# Altium schematic sheet FreshPal Schematic.SchDoc: FreshPal Schemtic V1
size 381 x 254 mm; Author: Tejus Samir; SheetNumber: 1; SheetTotal: 1
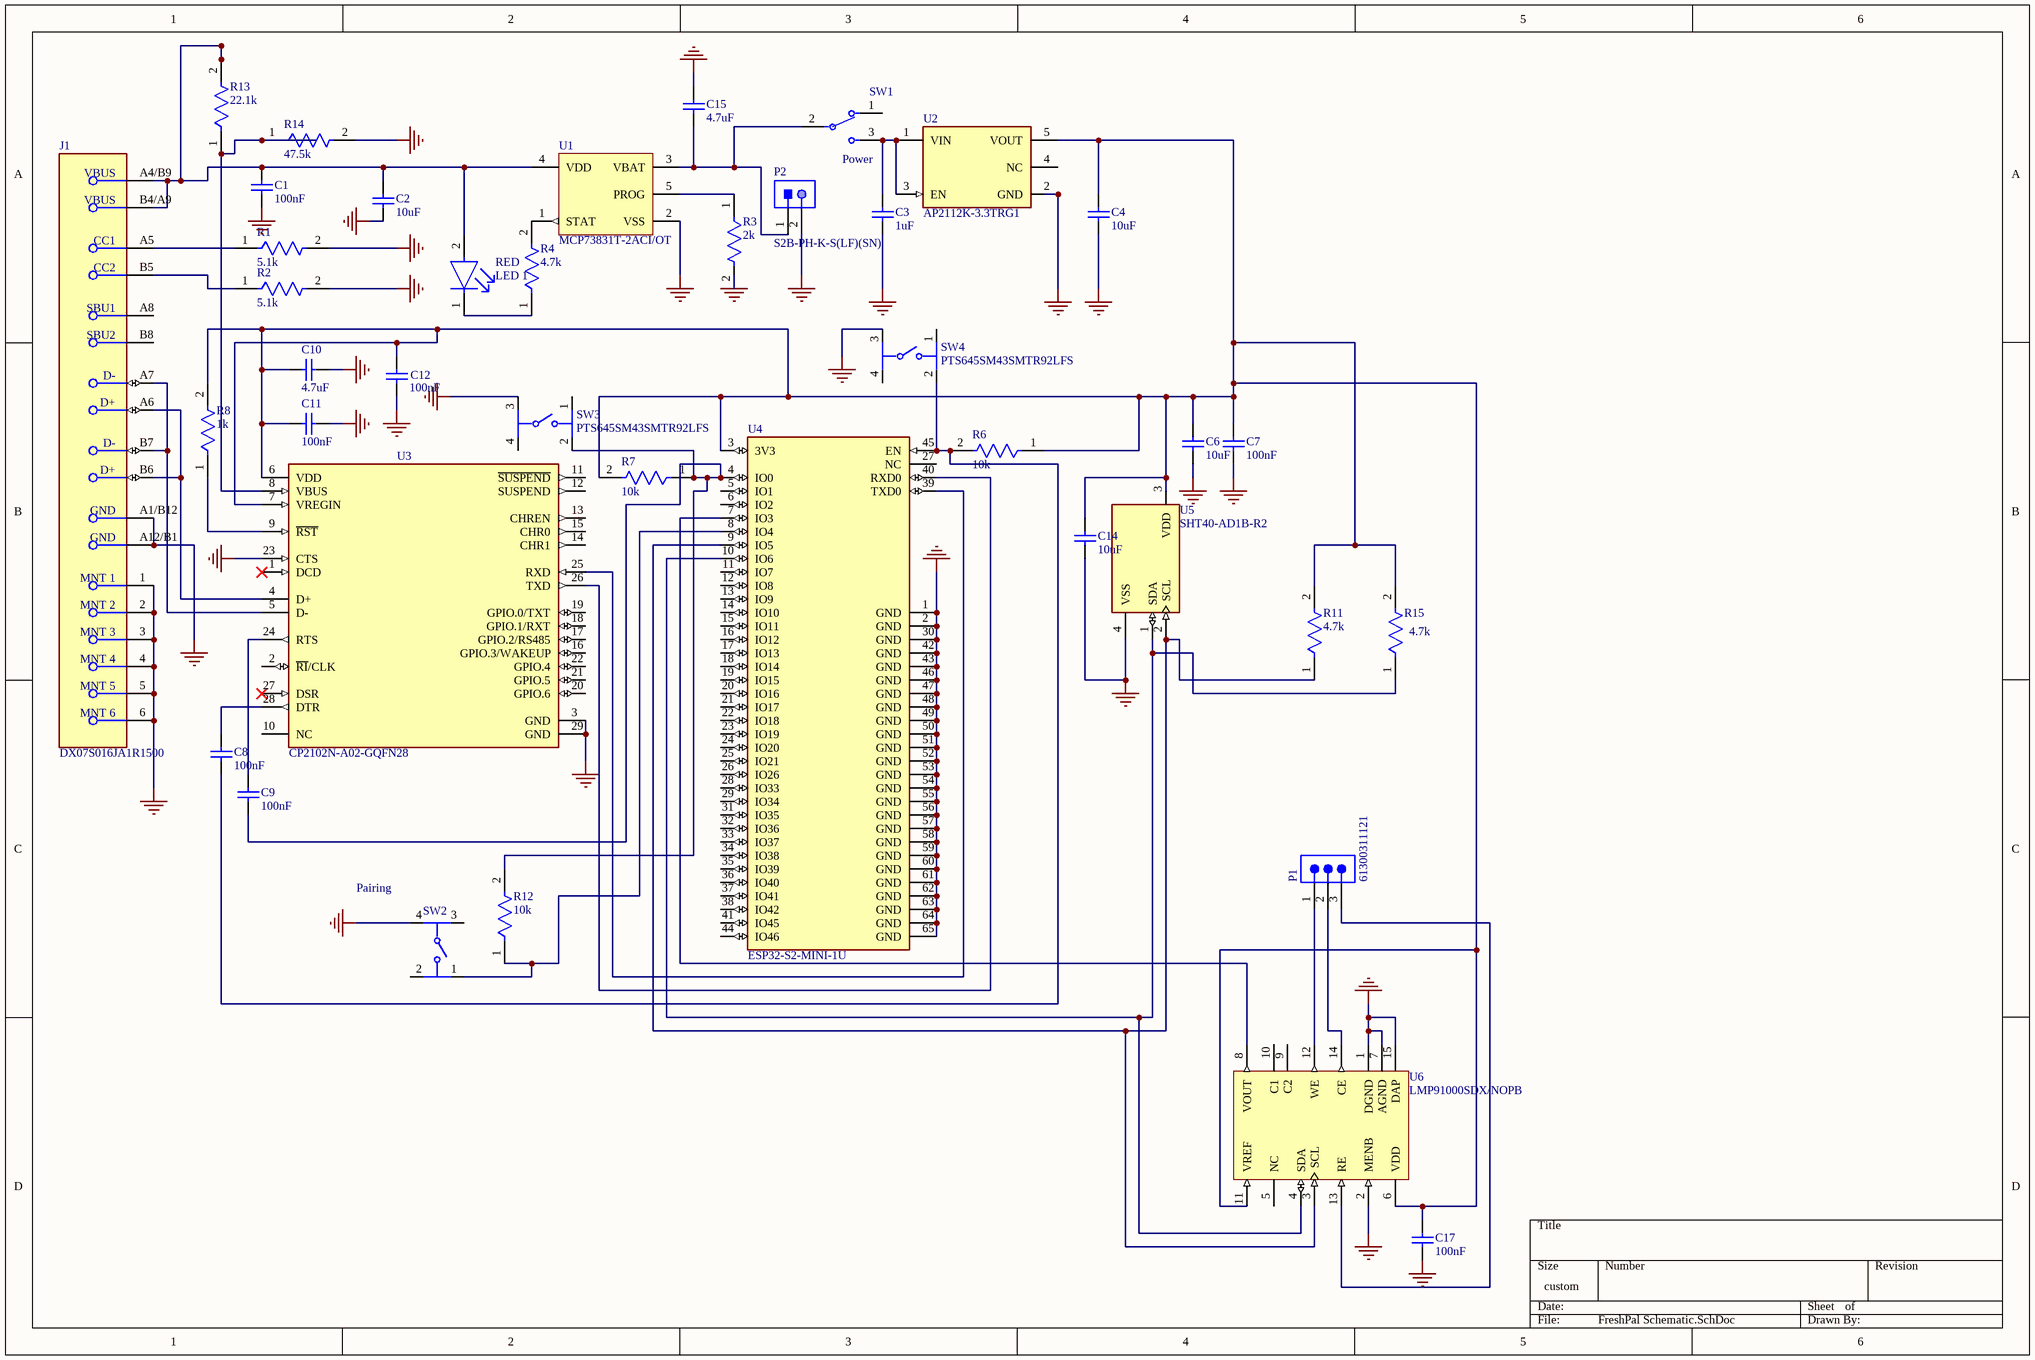
[diagram p0: FreshPal Schematic.SchDoc]

## Parts
C1  100nF  [CAPC0603(1608)100_L]
C2  10uF  [CAPC0603(1608)100_L]
C3  1uF  [CAPC0603(1608)100_L]
C4  10uF  [CAPC0603(1608)100_L]
C6  10uF  [CAPC0603(1608)100_L]
C7  100nF  [CAPC0603(1608)100_L]
C8  100nF  [CAPC0603(1608)100_L]
C9  100nF  [CAPC0603(1608)100_L]
C10  4.7uF  [CAPC0603(1608)100_L]
C11  100nF  [CAPC0603(1608)100_L]
C12  100nF  [CAPC0603(1608)100_L]
C14  10uF  [CAPC0603(1608)100_L]
C15  4.7uF  [CAPC0603(1608)100_L]
C17  100nF  [CAPC0603(1608)100_L]
J1  DX07S016JA1R1500  [FP-DX07S016JA1R1500-MFG]
P1  61300311121  [61300311121]
P2  S2B-PH-K-S(LF)(SN)  [JST-S2B-PH-K-S_V]
R1  5.1k  [FP-RN73R1E-MFG]
R2  5.1k  [FP-RN73R1E-MFG]
R3  2k  [FP-RN73R1E-IPC_B]
R4  4.7k  [FP-RN73R1E-MFG]
R6  10k  [FP-RN73R1E-MFG]
R7  10k  [FP-RN73R1E-MFG]
R8  1k  [FP-RN73R1E-MFG]
R11  4.7k  [FP-RN73R1E-MFG]
R12  10k  [FP-RN73R1E-MFG]
R13  22.1k  [FP-RN73R1E-MFG]
R14  47.5k  [FP-RN732A-MFG]
R15  4.7k  [FP-RN73R1E-MFG]
RED  LED 1  [FP-SML-P1-MFG]
SW1  S102011SCQN  [FP-JS102011SCQN-MFG]  (value not drawn)
SW2  (no value)  [PTS645SM43SMTR92LFS_MFG]
SW3  PTS645SM43SMTR92LFS  [PTS645SM43SMTR92LFS_MFG]
SW4  PTS645SM43SMTR92LFS  [PTS645SM43SMTR92LFS_MFG]
U1  MCP73831T-2ACI/OT  [SOT-23-OT5_M]
U2  AP2112K-3.3TRG1  [FP-SOT25-IPC_A]
U3  CP2102N-A02-GQFN28  [FP-CP2102N-A02-GQFN28-MFG]
U4  ESP32-S2-MINI-1U  [FP-ESP32-S2-MINI-1U-MFG]
U5  SHT40-AD1B-R2  [FP-SHT40-AD1B-R2-MFG]
U6  LMP91000SDX/NOPB  [NHL0014B_V]

## Nets
GND: C1.2 C2.2 C3.2 C4.2 C6.2 C7.2 C10.2 C11.2 C12.1 C14.2 C15.1 C17.1 J1.1(MNT_1) J1.2(MNT_2) J1.3(MNT_3) J1.4(MNT_4) J1.5(MNT_5) J1.6(MNT_6) J1.A1/B12(GND) J1.A12/B1(GND) P2.2 R1.2 R2.2 R3.2 R14.2 SW2.4 SW3.3 SW4.3 U1.2(VSS) U2.2(GND) U3.3(GND) U3.23(CTS) U3.29(GND) U4.1(GND) U4.2(GND) U4.30(GND) U4.42(GND) U4.43(GND) U4.46(GND) U4.47(GND) U4.48(GND) U4.49(GND) U4.50(GND) U4.51(GND) U4.52(GND) U4.53(GND) U4.54(GND) U4.55(GND) U4.56(GND) U4.57(GND) U4.58(GND) U4.59(GND) U4.60(GND) U4.61(GND) U4.62(GND) U4.63(GND) U4.64(GND) U4.65(GND) U5.4(VSS) U6.1(DGND) U6.2(MENB) U6.7(AGND) U6.15(DAP)
NetC1_1: C1.1 C2.1 J1.A4/B9(VBUS) J1.B4/A9(VBUS) R13.2 RED.2(A) U1.4(VDD)
NetC3_1: C3.1 SW1.3 U2.1(VIN) U2.3(EN)
NetC4_1: C4.1 C6.1 C7.1 C10.1 C11.1 C12.2 C14.1 C17.2 R6.1 R7.2 R8.2 R11.2 R15.2 U2.5(VOUT) U3.6(VDD) U3.7(VREGIN) U4.3(3V3) U5.3(VDD) U6.6(VDD) U6.11(VREF)
NetC8_1: C8.1 R6.2 SW4.2 U4.45(EN)
NetC8_2: C8.2 U3.28(DTR)
NetC9_1: C9.1 R7.1 R12.2 SW3.2 U4.4(IO0)
NetC9_2: C9.2 U3.24(RTS)
NetC15_2: C15.2 P2.1 SW1.2(C) U1.3(VBAT)
NetJ1_A5: J1.A5(CC1) R1.1
NetJ1_A6: J1.A6(D+) J1.B6(D+) U3.4(D+)
NetJ1_A7: J1.A7(D-) J1.B7(D-) U3.5(D-)
NetJ1_B5: J1.B5(CC2) R2.1
NetP1_1: P1.1 U6.12(WE)
NetP1_2: P1.2 U6.14(CE)
NetP1_3: P1.3 U6.13(RE)
NetR3_1: R3.1 U1.5(PROG)
NetR4_1: R4.1 RED.1(C)
NetR4_2: R4.2 U1.1(STAT)
NetR8_1: R8.1 U3.9(~{RST})
NetR11_1: R11.1 U4.9(IO5) U5.2(SCL) U6.3(SCL)
NetR12_1: R12.1 SW2.1 U4.8(IO4)
NetR13_1: R13.1 R14.1 U3.8(VBUS)
NetR15_1: R15.1 U4.10(IO6) U5.1(SDA) U6.4(SDA)
NetU3_25: U3.25(RXD) U4.39(TXD0)
NetU3_26: U3.26(TXD) U4.40(RXD0)
NetU4_7: U4.7(IO3) U6.8(VOUT)

Not connected (* = marked no-connect by the designer): J1 A8(SBU1) B8(SBU2); SW1 1; SW2 2 3; SW3 1 4; SW4 1 4; U2 4(NC); U3 1(DCD)* 2(~{RI}/CLK) 10(NC) 11(~{SUSPEND}) 12(SUSPEND) 13(CHREN) 14(CHR1) 15(CHR0) 16(GPIO.3/WAKEUP) 17(GPIO.2/RS485) 18(GPIO.1/RXT) 19(GPIO.0/TXT) 20(GPIO.6) 21(GPIO.5) 22(GPIO.4) 27(DSR)*; U4 5(IO1) 6(IO2) 11(IO7) 12(IO8) 13(IO9) 14(IO10) 15(IO11) 16(IO12) 17(IO13) 18(IO14) 19(IO15) 20(IO16) 21(IO17) 22(IO18) 23(IO19) 24(IO20) 25(IO21) 26(IO26) 27(NC) 28(IO33) 29(IO34) 31(IO35) 32(IO36) 33(IO37) 34(IO38) 35(IO39) 36(IO40) 37(IO41) 38(IO42) 41(IO45) 44(IO46); U6 5(NC) 9(C2) 10(C1)

## Notes on the sheet
- (near SW1) Power
- (near SW2) Pairing

## Library data of the parts
C1-C4 C6-C12 C14 C15 C17 = CMP-1035-00228-1: CAP 3.3pF 16V ±0.1pF 0603 (1608 Metric) Thickness 1mm SMD; Case-EIA: 0603; Tolerance: Â±0.1pF; Case-Metric: 1608; Max Thickness: 1 mm; Technology: SMT; Value: 3.3pF; Rated Voltage: 16 V
J1 = CMP-19038-000003-1: CONN RCP USB2.0 TYP C 24P SMD RA
P1 = CMP-1502-01062-4: THT Vertical Pin Header WR-PHD, Pitch 2.54 mm, Single Row, 3 pins; Connector Type: Male Pin; Number of Contacts: 3; Operating Supply Voltage: 250V; Current Rating: 3A; Pitch: 2.54mm; Contact Resistance: 20mΩ; Gender: Male; Height: 8.94mm; Color: Black; Min Operating Temperature: -40°C; Max Operating Temperature: 105°C; Mount: Through Hole; Termination: Solder; Number of Rows: 1; Packaging: Bulk; Number of Pins: 3; Lead Pitch: 2.54mm; RoHS: Compliant; Contact Plating: Gold; Number of Positions: 3; Lead Free: Lead Free; Voltage Rating: 250V; Contact Mating Length: 5.9944mm; Orientation: Vertical; Contact Material: Gold
P2 = CMP-1755-00004-1: Male Header, Pitch 2 mm, 1 x 2 Position, Height 4.8 mm, Tail Length 3.4 mm, -25 to 85 degC, RoHS, Bulk; Case\Package: Radial; Tolerance: 20%; Capacitance: 10 uF; Voltage Rating (DC): 50 V; Packaging: Bulk; ComponentLink1URL: http://www.jst-mfg.com/product/pdf/eng/ePH.pdf; Radiation Hardening: No; Height: 11 mm; Package Quantity: 200; PackageDescription: Male Header, Pitch 2 mm, 1 x 2 Position, Height 4.8 mm, Tail Length 3.4 mm; PackageReference: S2B-PH-K-S; Diameter: 5 mm; Pins: 2; Mount: Through Hole; Max Operating Temperature: 85 degC; Min Operating Temperature: -40 degC; ComponentLink1Description: Datasheet; DatasheetVersion: Dec-12; Length: 11 mm; Lead Pitch: 2 mm; REACH SVHC: No SVHC; Voltage Rating: 50 V; RoHSCompliant: true
R1 R2 R4 R6-R8 R11-R13 R15 = CMP-04015-057493-1: 5.1kΩ ±0.5% 0.063W, 1/16W Chip Resistor 0402 (1005 Metric) Moisture Resistant Thin Film
R3 = CMP-04015-046600-1: 2kΩ ±1% 0.063W, 1/16W Chip Resistor 0402 (1005 Metric) Moisture Resistant Thin Film
R14 = CMP-03211-001830-1: SMD Chip Resistor, Thin Film, 69.8KΩ, 100 V, 0805 [2012 Metric], 100 mW, 0.1%, RN73 Series; Manufacturer Part Number: RN73C2A69K8BTDF; Manufacturer: TE Connectivity; Voltage Rating: 100V; Power Rating: 0.1W; Temperature Coefficient: 10ppm/°C; Device Class L2: Resistors; Automotive: No; Octopart: https://octopart.com/rn73c2a69k8btdf-te+connectivity-42431909; Device Class L3: Chip SMD Resistors; Temperature Range High: 155°C; Package: RN732A; Resistance: 69.8KΩ; Temperature: -55°C to 155°C; RoHS: TRUE; Tolerance: 0.1%; octopart_url: https://octopart.com/rn73c2a69k8btdf-te+connectivity-42431909; Lead Free: Yes; Category: Res; Ipc Land Pattern Name: RESC200125X55; packaging: 1000 Reel; Value: 69.8KΩ; Height: 0.65mm; ComponentLink2URL: https://www.te.com/commerce/DocumentDelivery/DDEController?Action=showdoc&DocId=Data+Sheet%7F1773270%7FP%7Fpdf%7FEnglish%7FENG_DS_1773270_P.pdf%7F1676162-2; Composition: Thin Film; Temperature Range Low: -55°C; Device Class L1: Passive Components; ComponentLink2Description: Datasheet; Series: RN73
RED = CMP-08952-000003-1: LED RED CLEAR 1006 SMD; Manufacturer Part Number: SML-P11VTT86R; Manufacturer: Rohm; Led Orientation: Top View; Power Dissipation: 50mW; Wavelength: 626nm; Forward Voltage: 1.8V; Forward Current: 1mA; Luminous Intensity: 4mcd; Reverse Voltage: 5V; ComponentLink2URL: https://www.rohm.com/datasheet/SML-P11VT(R)/sml-p11-e; Temperature: -40°C to +85°C; Device Class L2: LEDs; Package: SML-P1; Category: Diode; Automotive: No; RoHS: TRUE; Lead Free: Yes; Digikey Description: LED RED CLEAR 1006 SMD; Device Class L3: unset; ComponentLink2Description: Datasheet; Octopart: https://octopart.com/sml-p11vtt86r-rohm-34112314; Device Class L1: Optoelectronics; Temperature Range High: +85°C; Temperature Range Low: -40°C; Mouser Description: SML-P11 Series Red 0402 Clear 4 mcd 1.8 V Surface Mount PICOLED? LED; Height: 0.25mm; Colour: Red
SW1 = CMP-10038-000023-1: SWITCH SLIDE SPDT 300MA 6V; Electrical Life: 5000Cycles; Actuator Type: Standard; Contact Resistance: 70mR; Actuator Material: Nylon; Max Voltage Rating (DC): 30V; Actuator Length: 2mm; Switch Function: On-On; Actuator Color: Black; Radiation Hardening: No; Throw Configuration: SPDT; Depth: 7.5mm; Case/Package: SMD/SMT; Package Quantity: 4000; Min Operating Temperature: -40°C; Length: 8.5mm; Current Rating: 300mA; Mount: Surface Mount; Voltage Rating (DC): 6V; RoHS Compliant: Yes; Orientation: Straight; Housing Material: Nylon; Contact Plating: Silver; Max Operating Temperature: 85°C; Packaging: Tape and Reel; Switch Travel: 2mm; Max Current Rating: 300mA; Contact Material: Copper Alloy; Series: JS; Termination: Gull Wing
SW2 = CMP-2000-05160-3: Switch Tactile N.O SPST Round Button Gull Wing 0.05A 12VDC 100000Cycle 1.57N SMD T/R; Manufacturer Package Identifier: PTS645SM43SMTR92LFS; Switch Function: Off-Mom; Life (Cycles): 100kcycles; Voltage Rating (DC): 12V; Actuator Material: Nylon, Polyamide; Max Current Rating: 50mA; Contact Resistance: 100mΩ; Number of Positions: 1; Actuator Length: 850µm; Illumination Type: Illuminated, Non-Illuminated; Insulation Resistance: 100GΩ; RoHS: Compliant; Electrical Life: 100kcycles; Lead Free: Lead Free; Contact Plating: Silver; Case/Package: SMD/SMT; Termination: Solder; Height: 3.45mm; ComponentLink1URL: http://www.ck-components.com/; Max Voltage Rating (DC): 12V; Lifecycle Status: Production; Min Operating Temperature: -20°C; Throw Configuration: SPST; China RoHS: Compliant; ComponentLink1Description: Manufacturer's Website; Operating Force: 1.57N; Depth: 9mm; Contact Material: Silver; Length: 6mm; Current Rating: 50mA; Color: Black; Contact Current Rating: 50mA; Mechanical Life: 100kcycles; ComponentLink2URL: https://www.ckswitches.com/media/1471/pts645.pdf; Orientation: Straight; Packaging: Cut Tape (CT); REACH SVHC: Yes; Max Operating Temperature: 60°C; ComponentLink2Description: Datasheet URL; HelpURL: https://www.ckswitches.com/media/1471/pts645.pdf; Mount: Surface Mount
SW3 SW4 = CMP-2000-05160-3: Switch Tactile N.O SPST Round Button Gull Wing 0.05A 12VDC 100000Cycle 1.57N SMD T/R; Switch Function: Off-Mom; Life (Cycles): 100kcycles; Voltage Rating (DC): 12V; Actuator Material: Nylon, Polyamide; Max Current Rating: 50mA; Contact Resistance: 100mΩ; Number of Positions: 1; Actuator Length: 850µm; Illumination Type: Illuminated, Non-Illuminated; Insulation Resistance: 100GΩ; RoHS: Compliant; Electrical Life: 100kcycles; Lead Free: Lead Free; Contact Plating: Silver; Case/Package: SMD/SMT; Termination: Solder; Height: 3.45mm; Manufacturer Package Identifier: PTS645SM43SMTR92LFS; ComponentLink1URL: http://www.ck-components.com/; Max Voltage Rating (DC): 12V; Lifecycle Status: Production; Min Operating Temperature: -20°C; Throw Configuration: SPST; China RoHS: Compliant; ComponentLink1Description: Manufacturer's Website; Operating Force: 1.57N; Depth: 9mm; Contact Material: Silver; Length: 6mm; Current Rating: 50mA; Color: Black; Contact Current Rating: 50mA; Mechanical Life: 100kcycles; ComponentLink2URL: https://www.ckswitches.com/media/1471/pts645.pdf; Orientation: Straight; Packaging: Cut Tape (CT); REACH SVHC: Yes; Max Operating Temperature: 60°C; ComponentLink2Description: Datasheet URL; HelpURL: https://www.ckswitches.com/media/1471/pts645.pdf; Mount: Surface Mount
U1 = CMP-0133-00142-1: Miniature Single-Cell, Fully Integrated Li-Ion, Li-Polymer Charge Management Controller, 4.2V, 5-Pin SOT-23, Industrial Temperature, Tape and Reel; PackageVersion: revBB, Aug-2009; DatasheetVersion: revE, Sep-2008; PackageDescription: 5-Lead Plastic Small Outline Transistor (OT) [SOT-23]; PackageReference: SOT-23-OT5; Code_IPC: SOT23-5
U2 = CMP-12756-000035-1: IC REG LINEAR 3.3V 600MA SOT25; Number of Regulators: 1; Output Type: Fixed; Polarity: Positive; Min Input Voltage: 2.5V; Max Input Voltage: 6V; Accuracy: 1.5%; Quiescent Current: 55uA; Dropout Voltage: 250mV; Min Operating Temperature: -40°C; Length: 3.1mm; Output Current: 600mA; Max Operating Temperature: 85°C; Package Quantity: 1; Output Voltage: 3.3V; Width: 1.7mm; Number of Outputs: 1; Packaging: Tape and Reel; Height: 1.3mm; Lead Free: Lead Free; Max Output Current: 600mA; Case/Package: SOT-23-5; Mount: Surface Mount; Number of Pins: 5
U3 = CMP-08093-000005-1: IC USB TO UART BRIDGE QFN28
U4 = CMP-194065-000010-1: SMD MODULE W/IPEX ANT CONNECTOR
U5 = CMP-144040-000008-1: SENSOR HUMIDITY 100 RH SMD
U6 = CMP-0064-00202-2: Configurable AFE Potentiostat for Low-Power Chemical Sensing Applications, 14-pin LLP, 4500 Reel; Manufacturer: Texas Instruments; PowerWise: N; CompType: OtherParts; PackageTopMarking: NS*UZXYTT*L91000; PinCount: 14; PackageDescription: LLP, Plastic, Dual, 4 x 4 x 0.8mm Body, 14 Lead, 0.5mm Pitch, No Pullback; PackageReference: NHL0014B; RoHS: Y; ComponentLink1Description: Datasheet URL; ComponentLink1URL: http://www.ti.com/general/docs/lit/getliterature.tsp?genericPartNumber=LMP91000&fileType=pdf